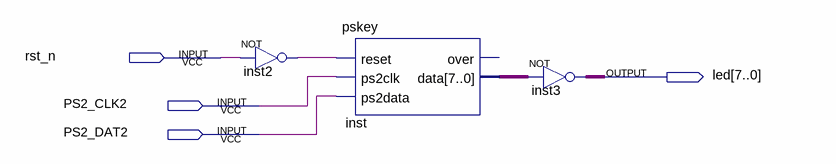
[diagram p0: schematic sheet]
// Quartus schematic pstop.bdf as structural Verilog: 3 symbols, 4 pins
module pstop (
  input  rst_n,
  input  PS2_CLK2,
  input  PS2_DAT2,
  output [7:0] led
);

  wire inst2_out;
  wire [7:0] inst_data;

  not inst2 (inst2_out, rst_n);
  pskey inst (.reset(inst2_out), .ps2clk(PS2_CLK2), .ps2data(PS2_DAT2), .data(inst_data));  // open: over
  assign led = ~inst_data;  // NOT inst3, 8 bits wide
endmodule
